# EasyEDA Pro project SingleEffect.eprj

# Schematic SigleEffect
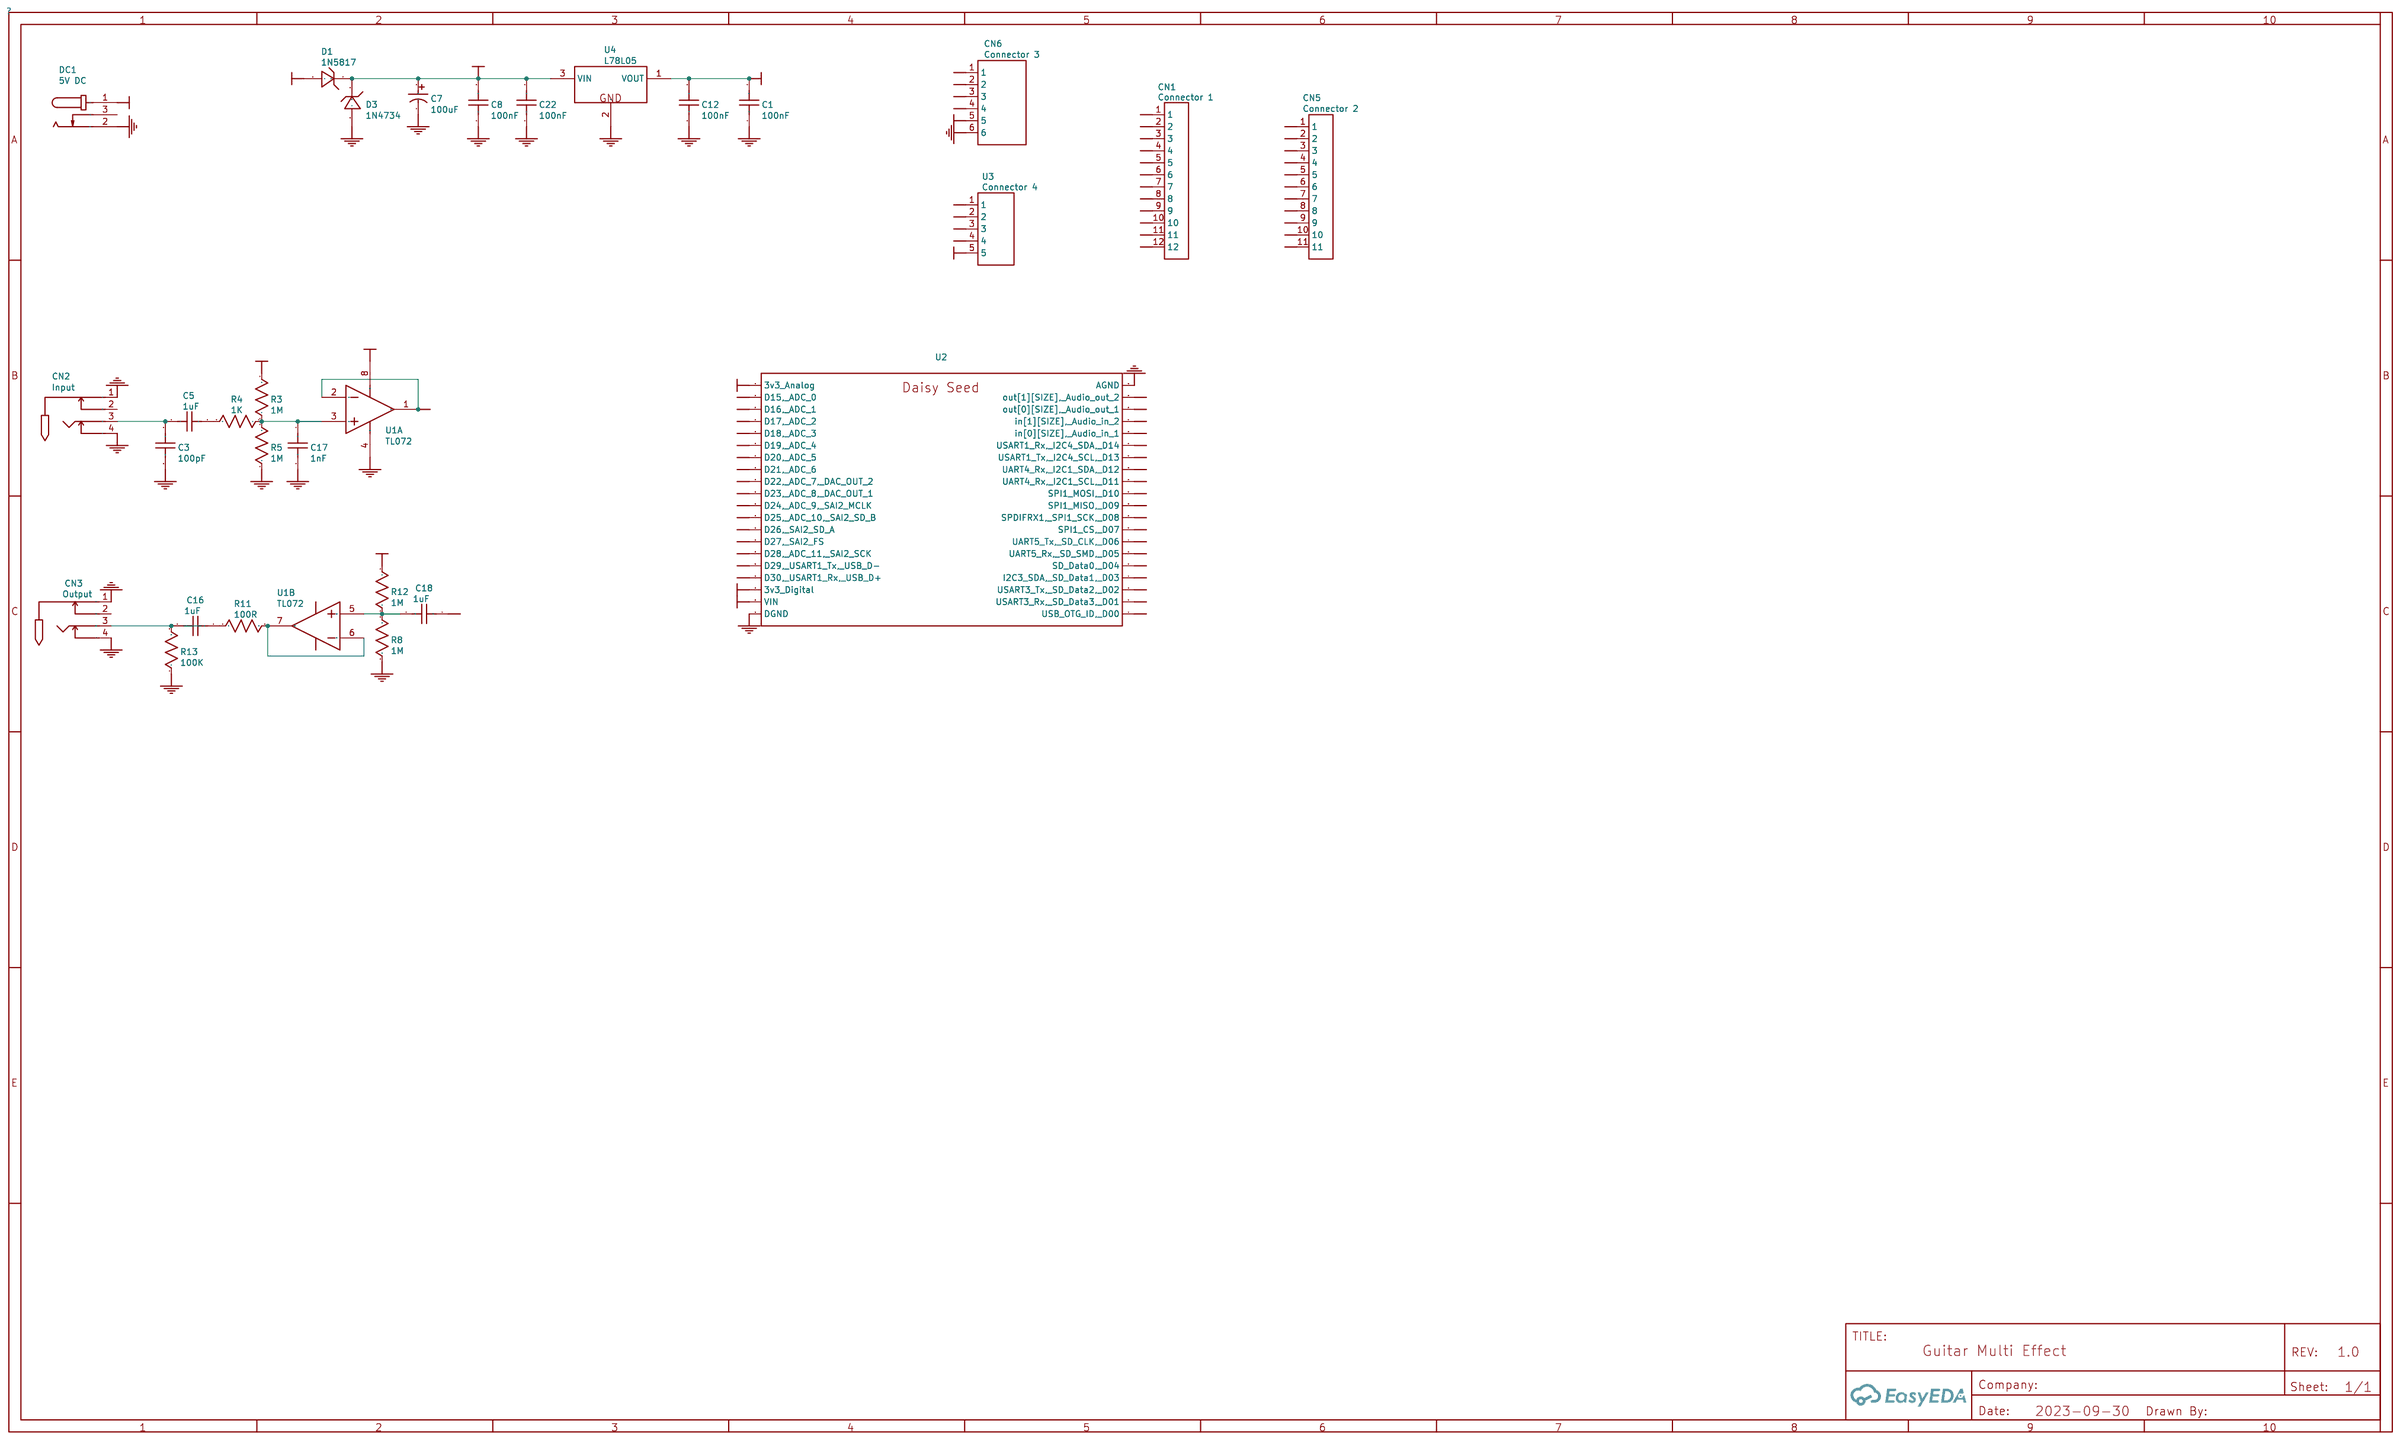
[diagram p0: schematic sheet]

## Parts
C1  100nF  [CAP-TH_L8.0-W4.0-P5.00-D0.7]
C3  100pF  [CAP-TH_L8.0-W4.0-P5.00-D0.7]
C5  1uF  [CAP-TH_L8.0-W4.0-P5.00-D0.7]
C7  100uF  [CAP-TH_BD5.0-P2.00-D0.8-FD]
C8  100nF  [CAP-TH_L8.0-W4.0-P5.00-D0.7]
C12  100nF  [CAP-TH_L8.0-W4.0-P5.00-D0.7]
C16  1uF  [CAP-TH_L8.0-W4.0-P5.00-D0.7]
C17  1nF  [CAP-TH_L8.0-W4.0-P5.00-D0.7]
C18  1uF  [CAP-TH_L8.0-W4.0-P5.00-D0.7]
C22  100nF  [CAP-TH_L8.0-W4.0-P5.00-D0.7]
CN1  Connector 1  [CONN-TH_12P-P2.00_A2001WV-12P]
CN2  Input  [AUDIO-TH_CK6.35-3-15-6]
CN3  Output  [AUDIO-TH_CK6.35-3-15-6]
CN5  Connector 2  [CONN-TH_11P-P2.00_PH11A]
CN6  Connector 3  [CONN-TH_B06B-PASK-1-LF-SN]
D1  1N5817  [DO-41_BD2.4-L4.7-P8.70-D0.9-RD]
D3  1N4734  [DO-41G_BD2.4-L4.0-P8.00-D0.7-RD]
DC1  5V DC  [CONN-TH_DC-005-2.5A-2.0]
R3  1M  [PS-RES-16.5*6.42]
R4  1K  [PS-RES-16.5*6.42]
R5  1M  [PS-RES-16.5*6.42]
R8  1M  [PS-RES-16.5*6.42]
R11  100R  [PS-RES-16.5*6.42]
R12  1M  [PS-RES-16.5*6.42]
R13  100K  [PS-RES-16.5*6.42]
U1  TL072  [DIP-8_L9.7-W6.6-P2.54-LS7.6-BL]  (sections 1,2)
U2  Daisy Seed  [DAISY_SEED]
U3  Connector 4  [CONN-TH_B5B-PH-K-S-LF-SN]
U4  L78L05  [TO-92-3_L4.9-W3.7-P1.27-L]

## Library data of the parts
C1 C8 C12 C22 = 100nF: Supplier: LCSC; Supplier Part: C249166; Manufacturer: STE(松田); Manufacturer Part: R08B1B102KN0B0S0N0; JLCPCB Part Class: Extended Part; link: https://lcsc.com/eda_search?q=C249166&%26type=1&ref=editor; nameAlias: Value; Contributor: LCSC; spicePre: C; spiceSymbolName: R08B1B102KN0B0S0N0
C3 = 100pF: Supplier: LCSC; Supplier Part: C249166; Manufacturer: STE(松田); Manufacturer Part: R08B1B102KN0B0S0N0; JLCPCB Part Class: Extended Part; link: https://lcsc.com/eda_search?q=C249166&%26type=1&ref=editor; nameAlias: Value; Contributor: LCSC; spicePre: C; spiceSymbolName: R08B1B102KN0B0S0N0
C5 C16 C18 = 1uF: Supplier: LCSC; Supplier Part: C249166; Manufacturer: STE(松田); Manufacturer Part: R08B1B102KN0B0S0N0; JLCPCB Part Class: Extended Part; link: https://lcsc.com/eda_search?q=C249166&%26type=1&ref=editor; nameAlias: Value; Contributor: LCSC; spicePre: C; spiceSymbolName: R08B1B102KN0B0S0N0
C7 = 100uF: Supplier: LCSC; Manufacturer: CX(承兴); Manufacturer Part: KM475M050D11RR0VH2FP0; Supplier Part: C43344; JLCPCB Part Class: Extended Part; link: https://lcsc.com/eda_search?q=C43344&%26type=1&ref=editor; nameAlias: Value; spicePre: C; spiceSymbolName: 4.7uF 50V 5*11
C17 = 1nF: Supplier: LCSC; Supplier Part: C249166; Manufacturer: STE(松田); Manufacturer Part: R08B1B102KN0B0S0N0; JLCPCB Part Class: Extended Part; link: https://lcsc.com/eda_search?q=C249166&%26type=1&ref=editor; nameAlias: Value; Contributor: LCSC; spicePre: C; spiceSymbolName: R08B1B102KN0B0S0N0
CN1 = Connector 1: Supplier: LCSC; Supplier Part: C225198; Manufacturer: CJT(长江连接器); Manufacturer Part: A2001WV-12P; JLCPCB Part Class: Extended Part; Contributor: LCSC; spicePre: C; spiceSymbolName: A2001WV-12P
CN2 = Input: Supplier: LCSC; Supplier Part: C718060; Manufacturer: JINJIA(金佳); Manufacturer Part: CK6.35-3+15-6; JLCPCB Part Class: Extended Part; link: https://lcsc.com/eda_search?q=C718060&%26type=1&ref=editor; Contributor: LCSC; spicePre: C; spiceSymbolName: CK6.35-3+15-6
CN3 = Output: Supplier: LCSC; Supplier Part: C718060; Manufacturer: JINJIA(金佳); Manufacturer Part: CK6.35-3+15-6; JLCPCB Part Class: Extended Part; link: https://lcsc.com/eda_search?q=C718060&%26type=1&ref=editor; Contributor: LCSC; spicePre: C; spiceSymbolName: CK6.35-3+15-6
CN5 = Connector 2: Supplier: LCSC; Manufacturer: BOOMELE(博穆精密); Manufacturer Part: PH-11A; Supplier Part: C10399; JLCPCB Part Class: Extended Part; spicePre: C; spiceSymbolName: PH-11A
CN6 = Connector 3: Supplier: LCSC; Supplier Part: C160281; Manufacturer: JST; Manufacturer Part: B06B-PASK-1(LF)(SN); JLCPCB Part Class: Extended Part; Contributor: LCSC; spicePre: C; spiceSymbolName: B06B-PASK-1 (LF)(SN)
D1 = 1N5817: Supplier: LCSC; Supplier Part: C360254; Manufacturer: PINGWEI(平伟); JLCPCB Part Class: Extended Part; Contributor: LCSC; spicePre: D; spiceSymbolName: 1N5817_C360254
D3 = 1N4734: Supplier: LCSC; Supplier Part: C391329; Manufacturer: PANJIT(强茂); Manufacturer Part: 1N4734A-G_AY_10001; JLCPCB Part Class: Extended Part; Contributor: LCSC; spicePre: D; spiceSymbolName: 1N4734A-G_AY_10001
DC1 = 5V DC: Supplier: LCSC; Supplier Part: C319098; Manufacturer: XKB Connectivity(中国星坤); Manufacturer Part: DC-005-2.5A-2.5; JLCPCB Part Class: Extended Part; Contributor: LCSC; spicePre: D; spiceSymbolName: DC-005-2.5A-2.5
R3 R5 R8 R12 = 1M: nameAlias: Value(Ω); Contributor: LCEDA_Lib; spicePre: R; spiceSymbolName: R_0603_US
R4 = 1K: nameAlias: Value(Ω); Contributor: LCEDA_Lib; spicePre: R; spiceSymbolName: R_0603_US
R11 = 100R: nameAlias: Value(Ω); Contributor: LCEDA_Lib; spicePre: R; spiceSymbolName: R_0603_US
R13 = 100K: nameAlias: Value(Ω); Contributor: LCEDA_Lib; spicePre: R; spiceSymbolName: R_0603_US
U1 = TL072: Supplier: LCSC; Supplier Part: C529228; Manufacturer: Gcore(扬州国芯); subpart_no: 1; spicePre: U; spiceSymbolName: TL072_C529228
U2 = Daisy Seed: Contributor: jjmens; spicePre: U
U3 = Connector 4: Supplier: LCSC; Supplier Part: C157993; Manufacturer: JST; Manufacturer Part: B5B-PH-K-S(LF)(SN); JLCPCB Part Class: Extended Part; Contributor: LCSC; spicePre: U; spiceSymbolName: B5B-PH-K-S-(LF)(SN)
U4 = L78L05: Supplier: LCSC; Manufacturer: ST(意法半导体); Manufacturer Part: L78L05ACZ; Supplier Part: C57900; JLCPCB Part Class: Extended Part; spicePre: U; spiceSymbolName: L78L05ACZ

## Nets
3V3A: CN6.5 U2.21(3v3 Analog)
3V3D: U2.38(3v3 Digital) U3.5
5V: C1.2 C12.2 R3.2 R12.2 U1.8(VCC+) U4.1(VOUT)
5VDCIN: D1.2(A) DC1.1
GND: C1.1 C3.2 C7.2 C8.1 C12.1 C17.2 C22.1 CN2.1 CN2.4 CN3.1 CN3.4 CN6.6 D3.2(A) DC1.2 R5.1 R8.1 R13.1 U1.4(VCC-) U2.20(AGND) U2.40(DGND) U4.2(GND)
VCC: C7.1 C8.2 C22.2 D1.1(C) D3.1(C) U2.39(VIN) U4.3(VIN)
A00/D15: CN1.1 U2.22(D15, ADC 0)
A01/D16: CN1.2 U2.23(D16, ADC 1)
A02/D17: CN1.3 U2.24(D17, ADC 2)
A03/D18: CN1.4 U2.25(D18, ADC 3)
A04/D19: CN1.5 U2.26(D19, ADC 4)
A05/D20: CN1.6 U2.27(D20, ADC 5)
A06/D21: CN1.7 U2.28(D21, ADC 6)
A07/D22: CN1.8 U2.29(D22, ADC 7, DAC OUT 2)
A08/D23: CN1.9 U2.30(D23, ADC 8, DAC OUT 1)
A09/D24: CN1.10 U2.31(D24, ADC 9, SAI2 MCLK)
A10/D25: CN1.11 U2.32(D25, ADC 10, SAI2 SD B)
A11/D28: CN1.12 U2.35(D28, ADC 11, SAI2 SCK)
D00: CN5.1 U2.1(USB OTG ID, D00)
D01: CN5.2 U2.2(USART3 Rx, SD Data3, D01)
D02: CN5.3 U2.3(USART3 Tx, SD Data2, D02)
D03: CN5.4 U2.4(I2C3 SDA, SD Data1, D03)
D04: CN5.5 U2.5(SD Data0, D04)
D05: CN5.6 U2.6(UART5 Rx, SD SMD, D05)
D06: CN5.7 U2.7(UART5 Tx, SD CLK, D06)
D07: CN5.8 U2.8(SPI1 CS, D07)
D08: CN5.9 U2.9(SPDIFRX1, SPI1 SCK, D08)
D09: CN5.10 U2.10(SPI1 MISO, D09)
D10: CN5.11 U2.11(SPI1 MOSI, D10)
D11: CN6.1 U2.12(UART4 Rx, I2C1 SCL, D11)
D12: CN6.2 U2.13(UART4 Rx, I2C1 SDA, D12)
D13: CN6.3 U2.14(USART1 Tx, I2C4 SCL, D13)
D14: CN6.4 U2.15(USART1 Rx, I2C4 SDA, D14)
D26: U2.33(D26, SAI2 SD A) U3.1
D27: U2.34(D27, SAI2 FS) U3.2
D29: U2.36(D29, USART1 Tx, USB D-) U3.3
D30: U2.37(D30, USART1 Rx, USB D+) U3.4
LINEINL: U1.1(1OUT) U1.2(1IN-) U2.16(in[0][SIZE], Audio in 1)
LINEINR: U2.17(in[1][SIZE], Audio in 2)
LINEOUTL: C18.1 U2.18(out[0][SIZE], Audio out 1)
LINEOUTR: U2.19(out[1][SIZE], Audio out 2)
C5_1: C3.1 C5.1 CN2.3
C16_1: C16.1 R11.1
C17_1: C17.1 R3.1 R4.1 R5.2 U1.3(1IN+)
R4_2: C5.2 R4.2
R11_2: R11.2 U1.6(2IN-) U1.7(2OUT)
R12_1: C18.2 R8.2 R12.1 U1.5(2IN+)
R13_2: C16.2 CN3.3 R13.2

Not connected (* = marked no-connect by the designer): CN2 2; CN3 2; DC1 3

# Board PCB_EasyEDA
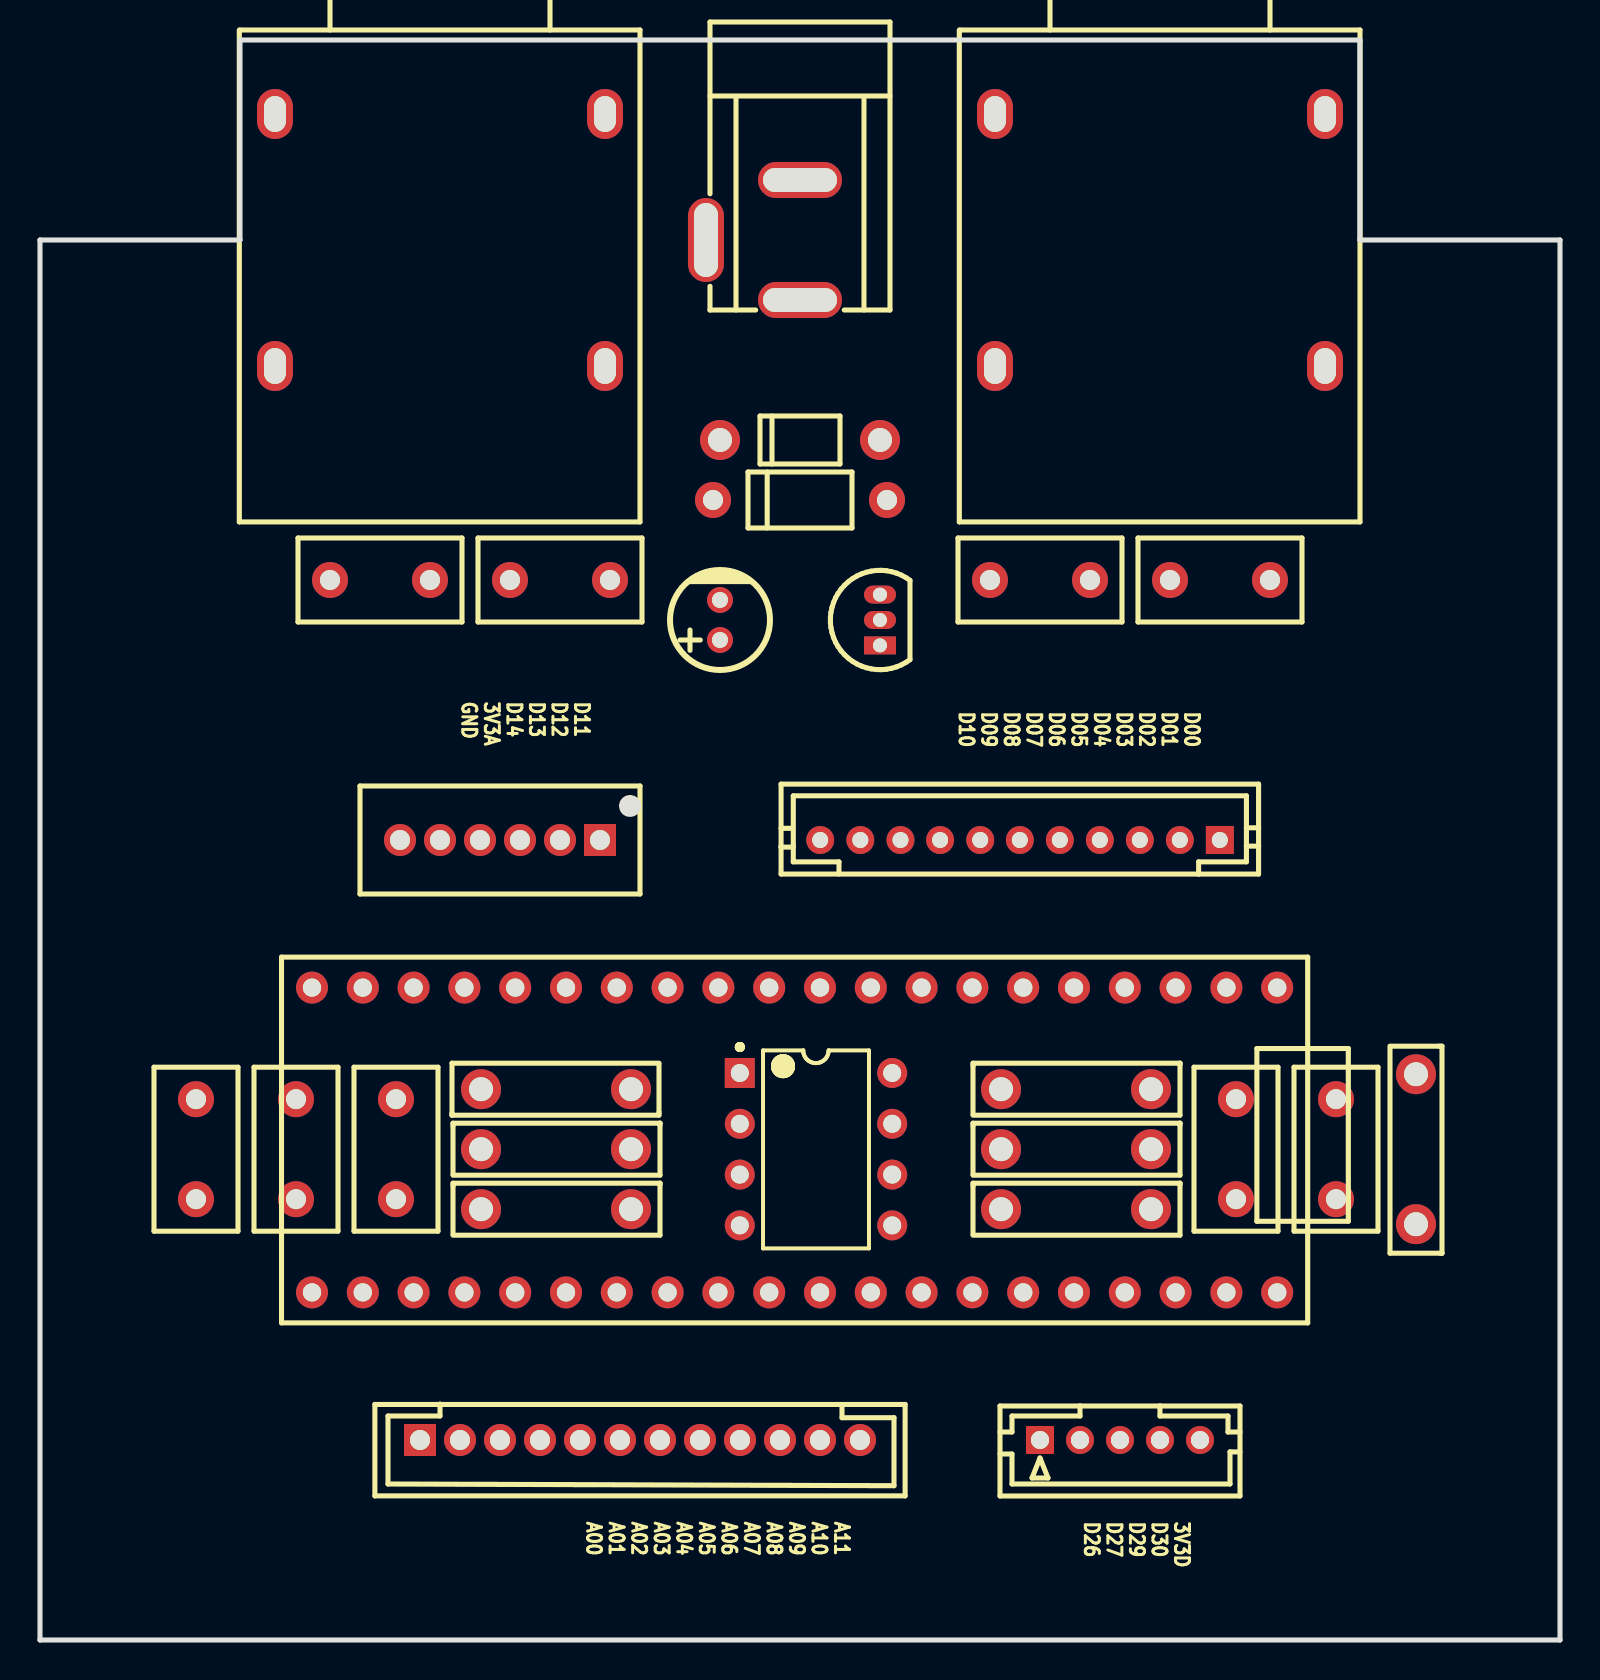
[diagram p1: board, top side]
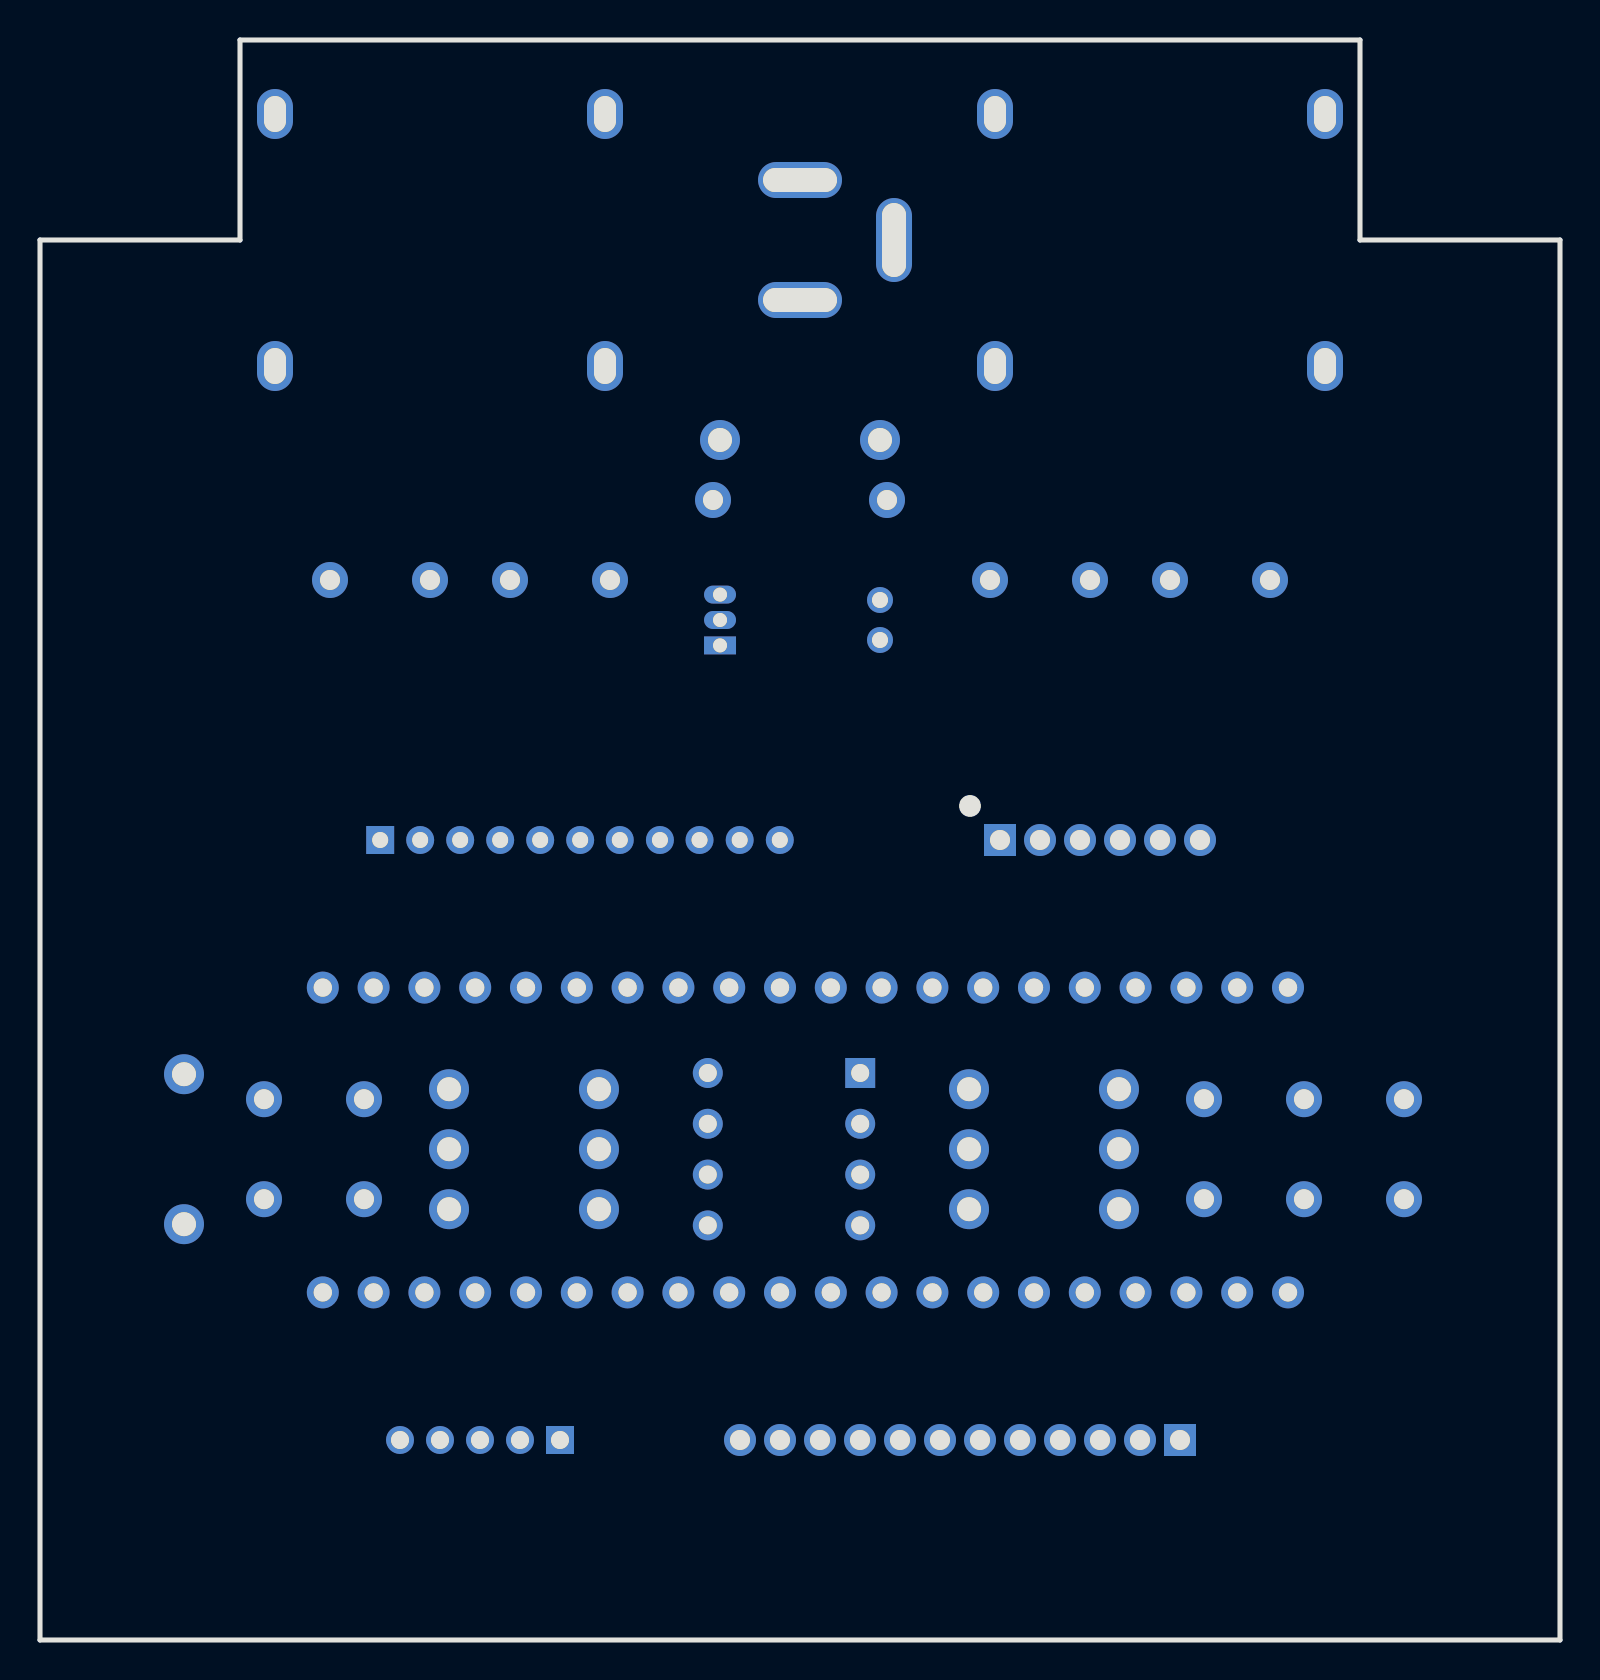
[diagram p2: board, bottom side, seen from below]

Outline 76 x 80 mm; copper layers: Top Layer, Bottom Layer. Coordinates in mm from the lower left corner of the outline.
Outline path: 0,70 10,70 10,80 66,80 66,70 76,70 76,0 0,0 0,70

## Design rules (mm)
via Default (default): diameter min 1, default 1, max 100.025; hole min 0.5, default 0.5, max 59.995
via V: diameter min 1, default 1, max 100.025; hole min 0.5, default 0.5, max 59.995
net 3V3D uses V
net 5VDCIN uses V
net 3V3A uses V
net GND uses V
net 5V uses V
net VCC uses V

## Placement (name value [footprint] x y rotation side)
C1  100nF  [CAP-TH_L8.0-W4.0-P5.00-D0.7]  50 53 0 top
C3  100pF  [CAP-TH_L8.0-W4.0-P5.00-D0.7]  7.8 24.54 90 top
C5  1uF  [CAP-TH_L8.0-W4.0-P5.00-D0.7]  12.8 24.54 90 top
C7  100uF  [CAP-TH_BD5.0-P2.00-D0.8-FD]  34 51 90 top
C8  100nF  [CAP-TH_L8.0-W4.0-P5.00-D0.7]  26 53 180 top
C12  100nF  [CAP-TH_L8.0-W4.0-P5.00-D0.7]  59 53 180 top
C16  1uF  [CAP-TH_L8.0-W4.0-P5.00-D0.7]  64.8 24.54 90 top
C17  1nF  [CAP-TH_L8.0-W4.0-P5.00-D0.7]  17.8 24.54 90 top
C18  1uF  [CAP-TH_L8.0-W4.0-P5.00-D0.7]  59.8 24.54 90 top
C22  100nF  [CAP-TH_L8.0-W4.0-P5.00-D0.7]  17 53 0 top
CN1  Connector 1  [CONN-TH_12P-P2.00_A2001WV-12P]  30 10 0 top
CN2  Input  [AUDIO-TH_CK6.35-3-15-6]  20 70 270 top
CN3  Output  [AUDIO-TH_CK6.35-3-15-6]  56 70 270 top
CN5  Connector 2  [CONN-TH_11P-P2.00_PH11A]  49 40 180 top
CN6  Connector 3  [CONN-TH_B06B-PASK-1-LF-SN]  23 40 0 top
D1  1N5817  [DO-41_BD2.4-L4.7-P8.70-D0.9-RD]  38 57 0 top
D3  1N4734  [DO-41G_BD2.4-L4.0-P8.00-D0.7-RD]  38 60 0 top
DC1  5V DC  [CONN-TH_DC-005-2.5A-2.0]  35.65 70 270 top
R3  1M  [PS-RES-16.5*6.42]  25.8 21.54 180 top
R4  1K  [PS-RES-16.5*6.42]  25.8 24.54 180 top
R5  1M  [PS-RES-16.5*6.42]  25.8 27.54 0 top
R8  1M  [PS-RES-16.5*6.42]  51.8 21.54 180 top
R11  100R  [PS-RES-16.5*6.42]  51.8 24.54 180 top
R12  1M  [PS-RES-16.5*6.42]  51.8 27.54 180 top
R13  100K  [PS-RES-16.5*6.42]  68.8 24.54 90 top
U1  TL072  [DIP-8_L9.7-W6.6-P2.54-LS7.6-BL]  38.8 24.54 270 top
U2  Daisy Seed  [DAISY_SEED]  39 25 90 top
U3  Connector 4  [CONN-TH_B5B-PH-K-S-LF-SN]  54 10 180 top
U4  L78L05  [TO-92-3_L4.9-W3.7-P1.27-L]  42 51 90 top

## Footprints (pads in the part's own frame, mm; a bottom-side part is the same pattern mirrored in y, then rotated)
AUDIO-TH_CK6.35-3-15-6
  oval 2.5x1.8 hole 1.8x1.1: 1(-6.3,-8.25) 2(-6.3,8.25) 3(6.3,-8.25) 4(6.3,8.25)
CAP-TH_BD5.0-P2.00-D0.8-FD
  round 1.3 hole 0.8: 1(-1,0) 2(1,0)
CAP-TH_L8.0-W4.0-P5.00-D0.7
  round 1.8 hole 1: 1(-2.5,0) 2(2.5,0)
CONN-TH_11P-P2.00_PH11A
  rect 1.4x1.4 hole 0.8: 1(-9.991,0)
  round 1.4 hole 0.8: 2(-7.992,0) 3(-5.992,0) 4(-3.991,0) 5(-1.992,0) 6(0.009,0) 7(1.99,0) 8(3.997,0) 9(5.978,0) 10(7.984,0) 11(9.991,0)
CONN-TH_12P-P2.00_A2001WV-12P
  rect 1.6x1.6 hole 1: 1(-11,0)
  round 1.6 hole 1: 2(-9,0) 3(-7,0) 4(-5,0) 5(-3,0) 6(-1,0) 7(1,0) 8(3,0) 9(5,0) 10(7,0) 11(9,0) 12(11,0)
CONN-TH_B5B-PH-K-S-LF-SN
  rect 1.4x1.4 hole 0.9: 1(4,0)
  round 1.4 hole 0.9: 2(2,0) 3(0,0) 4(-2,0) 5(-4,0)
CONN-TH_B06B-PASK-1-LF-SN
  rect 1.6x1.6 hole 1: 1(5,0)
  round 1.6 hole 1: 2(3,0) 3(1,0) 4(-1,0) 5(-3,0) 6(-5,0)
CONN-TH_DC-005-2.5A-2.0
  oval 1.8x4.2 hole 1.2x3.7: 1(3,2.35) 2(-2.999,2.35)
  oval 4.2x1.8 hole 3.7x1.2: 3(0,-2.35)
DAISY_SEED
  round 1.6 hole 0.914: 1(7.62,-22.86) 2(7.62,-20.32) 3(7.62,-17.78) 4(7.62,-15.24) 5(7.62,-12.7) 6(7.62,-10.16) 7(7.62,-7.62) 8(7.62,-5.08) 9(7.62,-2.54) 10(7.62,0) 11(7.62,2.54) 12(7.62,5.08) 13(7.62,7.62) 14(7.62,10.16) 15(7.62,12.7) 16(7.62,15.24) 17(7.62,17.78) 18(7.62,20.32) 19(7.62,22.86) 20(7.62,25.4) 21(-7.62,25.4) 22(-7.62,22.86) 23(-7.62,20.32) 24(-7.62,17.78) 25(-7.62,15.24) 26(-7.62,12.7) 27(-7.62,10.16) 28(-7.62,7.62) 29(-7.62,5.08) 30(-7.62,2.54) 31(-7.62,0) 32(-7.62,-2.54) 33(-7.62,-5.08) 34(-7.62,-7.62) 35(-7.62,-10.16) 36(-7.62,-12.7) 37(-7.62,-15.24) 38(-7.62,-17.78) 39(-7.62,-20.32) 40(-7.62,-22.86)
DIP-8_L9.7-W6.6-P2.54-LS7.6-BL
  rect 1.5x1.5 hole 0.9: 1(-3.81,-3.81)
  round 1.5 hole 0.9: 2(-1.27,-3.81) 3(1.27,-3.81) 4(3.81,-3.81) 5(3.81,3.81) 6(1.27,3.81) 7(-1.27,3.81) 8(-3.81,3.81)
DO-41_BD2.4-L4.7-P8.70-D0.9-RD
  round 1.8 hole 1: 1(-4.35,0) 2(4.35,0)
DO-41G_BD2.4-L4.0-P8.00-D0.7-RD
  round 2 hole 1.2: 1(-4,0) 2(4,0)
PS-RES-16.5*6.42
  round 2 hole 1.2: 1(-3.749,0) 2(3.749,0)
TO-92-3_L4.9-W3.7-P1.27-L
  rect 0.9x1.6 hole 0.7: 1(-1.27,0)
  oval 0.9x1.6 hole 0.7: 2(0,0) 3(1.27,0)

## Nets
As in the schematic.

## Text on the board
Top Silkscreen Layer: D11 / D12 / D13 / D14 / 3V3A / GND | A11 / A10 / A09 / A08 / A07 / A06 / A05 / A04 / A03 / A02 / A01 / A00 | 3V3D / D30 / D29 / D27 / D26 | D00 / D01 / D02 / D03 / D04 / D05 / D06 / D07 / D08 / D09 / D10
